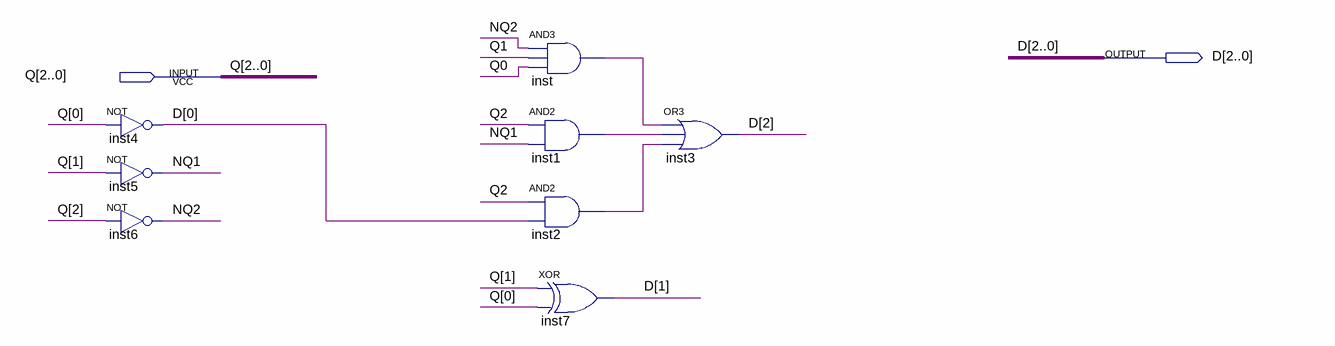
[diagram p0: schematic sheet]
// Quartus schematic NextState.bdf as structural Verilog: 8 symbols, 2 pins
module NextState (
  input  [2:0] Q,
  output [2:0] D
);

  wire inst1_out, inst2_out, inst_out, NQ1, NQ2;

  not inst4 (D[0], Q[0]);
  not inst5 (NQ1, Q[1]);
  not inst6 (NQ2, Q[2]);
  and inst (inst_out, NQ2, Q[1], Q[0]);
  and inst1 (inst1_out, Q[2], NQ1);
  and inst2 (inst2_out, Q[2], D[0]);
  xor inst7 (D[1], Q[1], Q[0]);
  or inst3 (D[2], inst_out, inst1_out, inst2_out);
endmodule
